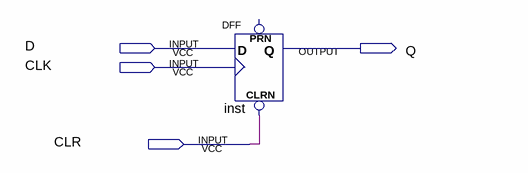
[diagram p0: schematic sheet]
// Quartus schematic FFD.bdf as structural Verilog: 1 symbols, 4 pins
module FFD (
  input  D,
  input  CLK,
  input  CLR,
  output Q
);

  DFF inst (.CLRN(CLR), .CLK(CLK), .D(D), .Q(Q));  // open: PRN
endmodule
